# Altium schematic sheet Radio.SchDoc: PCA100024 - Radio
size A4; Revision: 1.0.0; SheetNumber: 1; SheetTotal: 3; DrawnBy: RUBR; ProjectNumber: 4400; PCBRevision: 0141RUBR; DocumentSize: A4; PCAName: PCA10024; PCBNumber: 400081; ProjectName: nRF51822 mbed
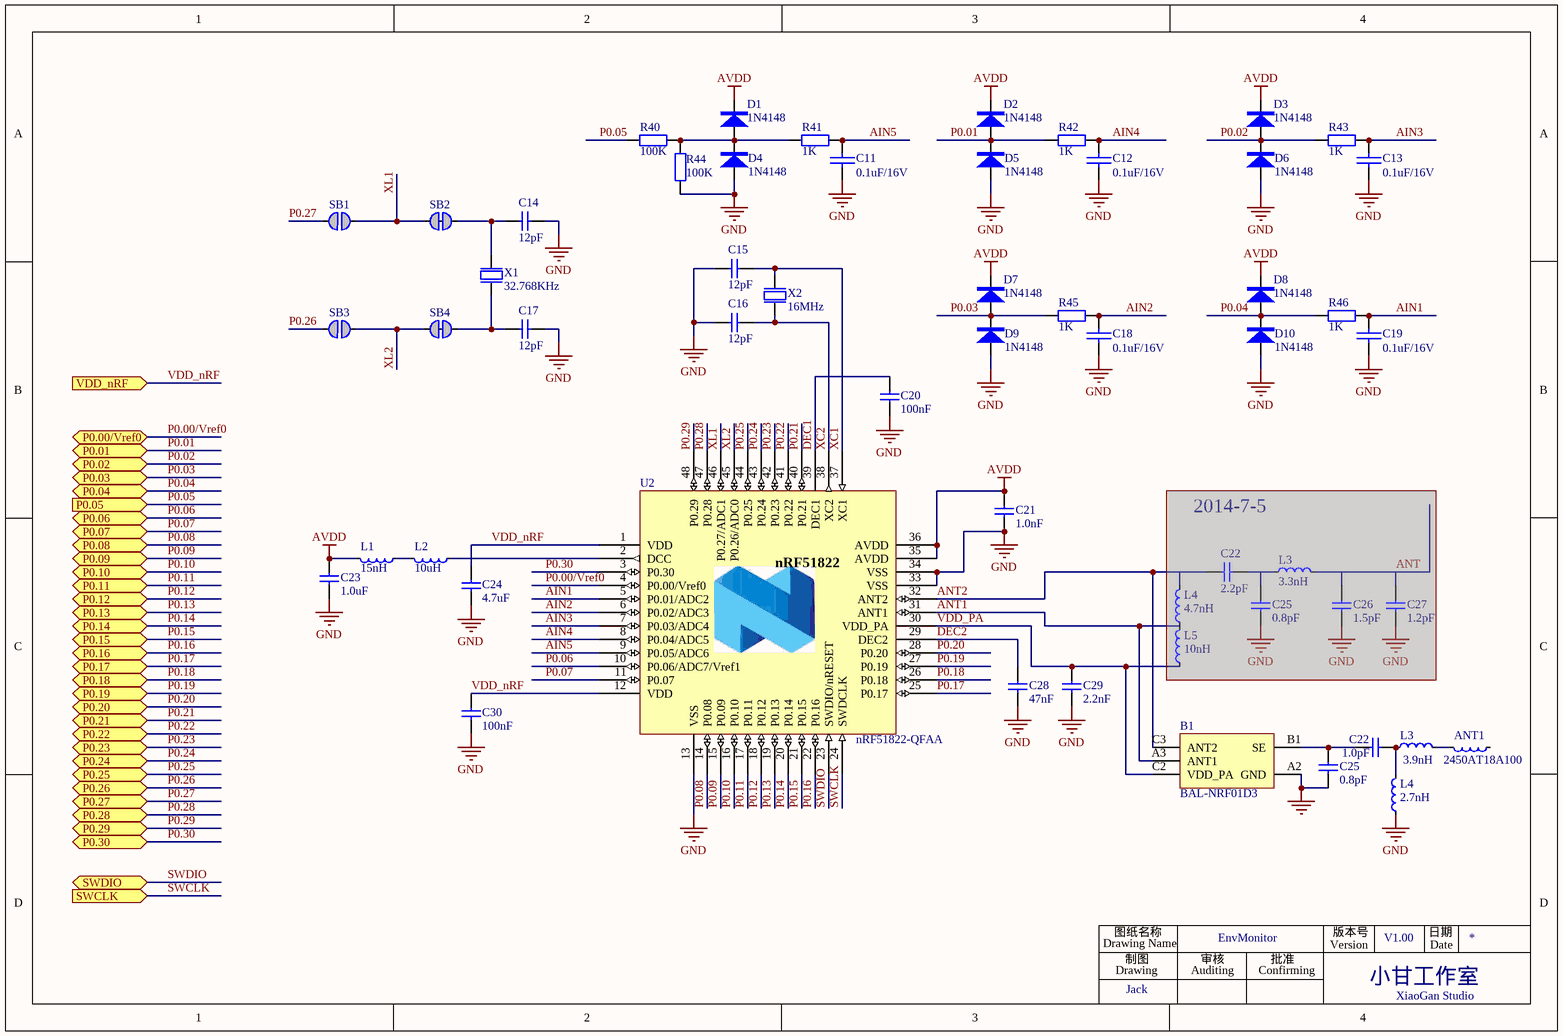
[diagram p0: Radio.SchDoc]

## Parts
(Parts that share a designator on the sheet are numbered #1, #2 ... from top to bottom, then left to right.)
ANT1  2450AT18A100
B1  BAL-NRF01D3  [BAL-ST-WLCSP]
C11  0.1uF/16V  [0603R]
C12  0.1uF/16V  [0603R]
C13  0.1uF/16V  [0603R]
C14  12pF  [0603R]
C15  12pF  [0603R]
C16  12pF  [0603R]
C17  12pF  [0603R]
C18  0.1uF/16V  [0603R]
C19  0.1uF/16V  [0603R]
C20  100nF  [0603R]
C21  1.0nF  [0603R]
C22#1  2.2pF  [0603R]  (masked out: inside a compile mask, not in the netlist)
C22#2  1.0pF  [0402c]
C23  1.0uF  [0603R]
C24  4.7uF  [0603R]
C25#1  0.8pF  [0603R]  (masked out: inside a compile mask, not in the netlist)
C25#2  0.8pF  [0402c]
C26  1.5pF  [0603R]  (masked out: inside a compile mask, not in the netlist)
C27  1.2pF  [0603R]  (masked out: inside a compile mask, not in the netlist)
C28  47nF  [0603R]
C29  2.2nF  [0603R]
C30  100nF  [0603R]
D1  1N4148  [SOD-123]
D2  1N4148  [SOD-123]
D3  1N4148  [SOD-123]
D4  1N4148  [SOD-123]
D5  1N4148  [SOD-123]
D6  1N4148  [SOD-123]
D7  1N4148  [SOD-123]
D8  1N4148  [SOD-123]
D9  1N4148  [SOD-123]
D10  1N4148  [SOD-123]
L1  15nH  [0603R]
L2  10uH  [0603R]
L3#1  3.3nH  [0603R]  (masked out: inside a compile mask, not in the netlist)
L3#2  3.9nH  [0402R]
L4#1  4.7nH  [0603R]  (masked out: inside a compile mask, not in the netlist)
L4#2  2.7nH  [0402R]
L5  10nH  [0603R]  (masked out: inside a compile mask, not in the netlist)
R40  100K  [0603R]
R41  1K  [0603R]
R42  1K  [0603R]
R43  1K  [0603R]
R44  100K  [0603R]
R45  1K  [0603R]
R46  1K  [0603R]
SB1  Solderbridge  [Solderbridge]  (value not drawn)  (no BOM)
SB2  Solderbridge  [Solderbridge_Shorted]  (value not drawn)  (net tie, no BOM)
SB3  Solderbridge  [Solderbridge]  (value not drawn)  (no BOM)
SB4  Solderbridge  [Solderbridge_Shorted]  (value not drawn)  (net tie, no BOM)
U2  nRF51822-QFAA  [QFN40P600X600X90-48N]
X1  32.768KHz  [CRY-32]
X2  16MHz  [XTAL-D]

## Ports
P0.00/Vref0 (bidir), P0.01 (bidir), P0.02 (bidir), P0.03 (bidir), P0.04 (bidir), P0.05 (in), P0.06 (bidir), P0.07 (bidir), P0.08 (bidir), P0.09 (bidir), P0.10 (bidir), P0.11 (bidir), P0.12 (bidir), P0.13 (bidir), P0.14 (bidir), P0.15 (bidir), P0.16 (bidir), P0.17 (bidir), P0.18 (bidir), P0.19 (bidir), P0.20 (bidir), P0.21 (bidir), P0.22 (bidir), P0.23 (bidir), P0.24 (bidir), P0.25 (bidir), P0.26 (bidir), P0.27 (bidir), P0.28 (bidir), P0.29 (bidir), P0.30 (bidir), SWCLK (in), SWDIO (bidir), VDD_nRF (in)

## Nets
AVDD: C21.1 C23.2 D1.2 D2.2 D3.2 D7.2 D8.2 L1.2 U2.35(AVDD) U2.36(AVDD)
GND: B1.A2(GND) C11.2(P2) C12.2(P2) C13.2(P2) C14.2 C15.2 C16.2 C17.2 C18.2(P2) C19.2(P2) C20.2 C21.2 C23.1 C24.2 C25#2.1 C28.2 C29.2 C30.2 D4.1 D5.1 D6.1 D9.1 D10.1 L4#2.1 R44.1 U2.13(VSS) U2.33(VSS) U2.34(VSS) U2.49
AIN1: C19.1(P1) R46.2 U2.5(P0.01/ADC2)
AIN2: C18.1(P1) R45.2 U2.6(P0.02/ADC3)
AIN3: C13.1(P1) R43.2 U2.7(P0.03/ADC4)
AIN4: C12.1(P1) R42.2 U2.8(P0.04/ADC5)
AIN5: C11.1(P1) R41.2 U2.9(P0.05/ADC6)
ANT1: B1.A3(ANT1) U2.31(ANT1)
ANT2: B1.C3(ANT2) U2.32(ANT2)
DEC1: C20.1 U2.39(DEC1)
DEC2: C28.1 U2.29(DEC2)
P0.00/Vref0: U2.4(P0.00/Vref0) ; port P0.00/Vref0
P0.01: D2.1 D5.2 R42.1 ; port P0.01
P0.02: D3.1 D6.2 R43.1 ; port P0.02
P0.03: D7.1 D9.2 R45.1 ; port P0.03
P0.04: D8.1 D10.2 R46.1 ; port P0.04
P0.05: R40.2 ; port P0.05
P0.06: U2.10(P0.06/ADC7/Vref1) ; port P0.06
P0.07: U2.11(P0.07) ; port P0.07
P0.08: U2.14(P0.08) ; port P0.08
P0.09: U2.15(P0.09) ; port P0.09
P0.10: U2.16(P0.10) ; port P0.10
P0.11: U2.17(P0.11) ; port P0.11
P0.12: U2.18(P0.12) ; port P0.12
P0.13: U2.19(P0.13) ; port P0.13
P0.14: U2.20(P0.14) ; port P0.14
P0.15: U2.21(P0.15) ; port P0.15
P0.16: U2.22(P0.16) ; port P0.16
P0.17: U2.25(P0.17) ; port P0.17
P0.18: U2.26(P0.18) ; port P0.18
P0.19: U2.27(P0.19) ; port P0.19
P0.20: U2.28(P0.20) ; port P0.20
P0.21: U2.40(P0.21) ; port P0.21
P0.22: U2.41(P0.22) ; port P0.22
P0.23: U2.42(P0.23) ; port P0.23
P0.24: U2.43(P0.24) ; port P0.24
P0.25: U2.44(P0.25) ; port P0.25
P0.26: SB3.2 ; port P0.26
P0.27: SB1.2 ; port P0.27
P0.28: U2.47(P0.28) ; port P0.28
P0.29: U2.48(P0.29) ; port P0.29
P0.30: U2.3(P0.30) ; port P0.30
SWCLK: U2.24(SWDCLK) ; port SWCLK
SWDIO: U2.23(SWDIO/nRESET) ; port SWDIO
VDD_nRF: C24.1 C30.1 U2.1(VDD) U2.12(VDD) ; port VDD_nRF
VDD_PA: B1.C2(VDD_PA) C29.1 U2.30(VDD_PA)
XC1: C15.1 U2.37(XC1) X2.2(out)
XC2: C16.1 U2.38(XC2) X2.1(inp)
XL1: SB1.1 SB2.2 U2.46(P0.27/ADC1)
XL2: SB3.1 SB4.2 U2.45(P0.26/ADC0)
NetANT1_2: ANT1.2 L3#2.2
NetB1_B1: B1.B1(SE) C22#2.1 C25#2.2
NetC14_1: C14.1 SB2.1 X1.2(out)
NetC17_1: C17.1 SB4.1 X1.1(inp)
NetC22#2_2: C22#2.2 L3#2.1 L4#2.2
NetD1_1: D1.1 D4.2 R40.1 R41.1 R44.2
NetL1_1: L1.1 L2.2
NetL2_1: L2.1 U2.2(DCC)

Not connected (* = marked no-connect by the designer): ANT1 1

## Notes on the sheet
- 2014-7-5
- Drawing Name
- 图纸名称
- Drawing
- 制图
- Auditing
- 审核
- EnvMonitor
- Confirming
- 批准
- Version
- 版本号
- 小甘工作室
- V1.00
- 日期
- Date
- Jack
- XiaoGan Studio
- (in symbol nRF51822_QFAA) nRF51822

## Library data of the parts
ANT1 L3#2 L4#2 = L0402-3n3: Inductor, 190mA, ?.1nH; Manufacturer: Murata; Manufacturer Part Number: LQP15MN3N3B02D; Value: 3.3nH; Note: High frequency chip inductor ?%; Artikkelnr Noca: 33029369; Part Number: L0402-3n3; Datasheet: http://search.murata.co.jp/Ceramy/image/img/PDF/ENG/L0075S0084LQP15M.pdf; LatestRevisionDate: 2012-09-19; Pin Count: 2; Publisher: Nordic Semiconductor; Published: 2009-05-08; Supplier: Digi-Key; Supplier part number: 490-1130-1-ND; 2nd source Supplier: *; 2nd source part number: *
B1 = BAL-NRF02D3: 50 ohm balun transformer for 2.45GHz ISM; Manufacturer: ST; Artikkelnr Noca: N.A.; Part Number: BAL-NRF02D3; Manufacturer Part Number: BAL-NRF02D3; Datasheet: *; LatestRevisionDate: 2013-05-15; Pin Count: 5; Publisher: Nordic Semiconductor; Published: 2013-05-15; Value: BAL-NRF02D3; Note: BAL-NRF02D3; Supplier: *; Supplier part number: *; 2nd source Supplier: *; 2nd source part number: *
C11-C13 C18 C19 = CAP: 贴片陶瓷电容; Kind: 贴片陶瓷电容
C14-C17 = C0402-12p: Capacitor, NP0, ?%; Note: 50V; Artikkelnr Noca: 20029159; Part Number: C0402-12p; Manufacturer: *; Manufacturer Part Number: *; Datasheet: *; LatestRevisionDate: 2011-05-11; Pin Count: 2; Publisher: Nordic Semiconductor; Published: 2009-05-08; Value: 12pF; Supplier: *; Supplier part number: *; 2nd source Supplier: *; 2nd source part number: *
C20 C30 = C0402-100n: Capacitor, X7R, ?0%; Note: 16V; Artikkelnr Noca: 20039200; Part Number: C0402-100n; Manufacturer: *; Manufacturer Part Number: *; Datasheet: *; LatestRevisionDate: 2009-11-23; Pin Count: 2; Publisher: Nordic Semiconductor; Published: 2009-05-08; Value: 100nF; Supplier: *; Supplier part number: *; 2nd source Supplier: *; 2nd source part number: *
C21 = C0402-1n0: Capacitor, X7R, ?0%; Note: 50V; Artikkelnr Noca: 20039223; Part Number: C0402-1n0; Manufacturer: *; Manufacturer Part Number: *; Datasheet: *; LatestRevisionDate: 2009-11-23; Pin Count: 2; Publisher: Nordic Semiconductor; Published: 2009-05-08; Value: 1.0nF; Supplier: *; Supplier part number: *; 2nd source Supplier: *; 2nd source part number: *
C22#1 = C0402-2.2p: Capacitor, NP0, ?.1pF; Note: 50V; Artikkelnr Noca: 20029145; Part Number: C0402-2.2p; Manufacturer: *; Manufacturer Part Number: *; Datasheet: *; LatestRevisionDate: 2009-05-08; Pin Count: 2; Publisher: Nordic Semiconductor; Published: 2009-05-08; Value: 2.2pF; Supplier: *; Supplier part number: *; 2nd source Supplier: *; 2nd source part number: *
C22#2 = C0402-0.8p: Capacitor, NP0, ?%; Value: 0.8pF; Note: 50V; Artikkelnr Noca: 20029147; Part Number: C0402-0.8p; Manufacturer: *; Manufacturer Part Number: *; Datasheet: *; LatestRevisionDate: 2012-11-21; Pin Count: 2; Publisher: Nordic Semiconductor; Published: 2009-05-08; Supplier: *; Supplier part number: *; 2nd source Supplier: *; 2nd source part number: *
C23 = C0603-1?: Capacitor, X7R, ?0%; Value: 1.0µF; Note: 16V; Artikkelnr Noca: 20039335; Part Number: C0603-1?; Manufacturer: *; Manufacturer Part Number: *; Datasheet: *; Footprint: 0603; LatestRevisionDate: 2013-06-05; Pin Count: 2; Publisher: Nordic Semiconductor; Published: 2009-05-08; Supplier: *; Supplier part number: *; 2nd source Supplier: *; 2nd source part number: *
C24 = C0603-4?: Capacitor, X5R, ?0%; Value: 4.7µF; Note: 6.3V; Artikkelnr Noca: 20069060; Part Number: C0603-4?; Manufacturer: *; Manufacturer Part Number: *; Datasheet: *; Footprint: 0603; LatestRevisionDate: 2009-11-23; Pin Count: 2; Publisher: Nordic Semiconductor; Published: 2009-05-08; Supplier: *; Supplier part number: *; 2nd source Supplier: *; 2nd source part number: *
C25#1 C25#2 = C0402-0.8p: Capacitor, NP0, ?%; Note: 50V; Artikkelnr Noca: 20029147; Part Number: C0402-0.8p; Manufacturer: *; Manufacturer Part Number: *; Datasheet: *; LatestRevisionDate: 2012-11-21; Pin Count: 2; Publisher: Nordic Semiconductor; Published: 2009-05-08; Value: 0.8pF; Supplier: *; Supplier part number: *; 2nd source Supplier: *; 2nd source part number: *
C26 = C0402-1.5p: Capacitor, NP0, ?.1pF; Note: 50V; Artikkelnr Noca: 20029139; Part Number: C0402-1.5p; Manufacturer: *; Manufacturer Part Number: *; Datasheet: *; LatestRevisionDate: 2009-11-23; Pin Count: 2; Publisher: Nordic Semiconductor; Published: 2009-05-08; Value: 1.5pF; Supplier: *; Supplier part number: *; 2nd source Supplier: *; 2nd source part number: *
C27 = C0402-1.2p: Capacitor, NP0, ?.1pF; Note: 50V; Artikkelnr Noca: 20029157; Part Number: C0402-1.2p; Manufacturer: *; Manufacturer Part Number: *; Datasheet: *; LatestRevisionDate: 2011-05-11; Pin Count: 2; Publisher: Nordic Semiconductor; Published: 2009-05-08; Value: 1.2pF; Supplier: *; Supplier part number: *; 2nd source Supplier: *; 2nd source part number: *
C28 = C0402-47n: Capacitor, X7R, ?0%; Note: Chip Cap 10%; Artikkelnr Noca: 20039389; Part Number: C0402-47n; Manufacturer: *; Manufacturer Part Number: *; Datasheet: *; LatestRevisionDate: 2009-05-08; Pin Count: 2; Publisher: Nordic Semiconductor; Published: 2009-05-08; Value: 47nF; Supplier: *; Supplier part number: *; 2nd source Supplier: *; 2nd source part number: *
C29 = C0402-2n2: Capacitor, X7R, ?0%; Note: 50V; Artikkelnr Noca: 20039221; Part Number: C0402-2n2; Manufacturer: *; Manufacturer Part Number: *; Datasheet: *; LatestRevisionDate: 2009-11-23; Pin Count: 2; Publisher: Nordic Semiconductor; Published: 2009-05-08; Value: 2.2nF; Supplier: *; Supplier part number: *; 2nd source Supplier: *; 2nd source part number: *
D1-D10 = DIODE: 贴片二极管; Remark: 可用1N5819替代; Kind: 贴片二极管
L1 = L0402-15n: Inductor, 320mA, ?%; Manufacturer: Taiyo Yuden; Manufacturer Part Number: HK100515NJ-T; 2nd source part number: 658-1328; Note: High frequency chip inductor ?0%; Artikkelnr Noca: 33029323; Part Number: L0402-15n; LatestRevisionDate: 2012-09-19; Pin Count: 2; Publisher: Nordic Semiconductor; Published: 2010-07-12; Value: 15nH; Supplier: Digi-Key; Datasheet: http://www.yuden.co.jp/productdata/catalog/en/mlci04_e.pdf; Supplier part number: 587-1521-1-ND; 2nd source Supplier: Farnell
L2 = L0603-10?: Inductor, 80mA, ?0%; Part Number: L0603-10祹ISHIDDEN=T; Manufacturer: Taiyo Yuden; Manufacturer Part Number: LBMF1608T100K; 2nd source part number: 178-6105; Value: 10µH; Note: LBMF1608T100K 10µH 80mA 0603; Artikkelnr Noca: 33029314; Datasheet: http://www.yuden.co.jp/ut/product/pdf/elb2_e.pdf; LatestRevisionDate: 2012-09-19; Pin Count: 2; Publisher: Nordic Semiconductor; Published: 2010-02-24; Supplier: Digi-Key; Supplier part number: 587-1714-1-ND; 2nd source Supplier: Farnell
L3#1 = L0402-3n3: Inductor, 190mA, ?.1nH; Manufacturer: Murata; Manufacturer Part Number: LQP15MN3N3B02D; Note: High frequency chip inductor ?%; Artikkelnr Noca: 33029369; Part Number: L0402-3n3; Datasheet: http://search.murata.co.jp/Ceramy/image/img/PDF/ENG/L0075S0084LQP15M.pdf; LatestRevisionDate: 2012-09-19; Pin Count: 2; Publisher: Nordic Semiconductor; Published: 2009-05-08; Value: 3.3nH; Supplier: Digi-Key; Supplier part number: 490-1130-1-ND; 2nd source Supplier: *; 2nd source part number: *
L4#1 = L0402-4n7: Inductor, 160mA, ?.1nH; Manufacturer: Murata; Manufacturer Part Number: LQP15MN4N7B02D; Note: High frequency chip inductor ?%; Artikkelnr Noca: 33029164; Part Number: L0402-4n7; Datasheet: http://search.murata.co.jp/Ceramy/image/img/PDF/ENG/L0075S0084LQP15M.pdf; LatestRevisionDate: 2012-09-19; Pin Count: 2; Publisher: Nordic Semiconductor; Published: 2009-05-08; Value: 4.7nH; Supplier: Digi-Key; Supplier part number: 490-1132-1-ND; 2nd source Supplier: *; 2nd source part number: *
L5 = L0402-10n: Inductor, 100mA, ?%; Manufacturer: Murata; Manufacturer Part Number: LQP15MN10NG02D; Note: High frequency chip inductor ?%; Artikkelnr Noca: 33029425; Part Number: L0402-10n; Datasheet: http://search.murata.co.jp/Ceramy/image/img/PDF/ENG/L0075S0084LQP15M.pdf; LatestRevisionDate: 2012-09-19; Pin Count: 2; Publisher: Nordic Semiconductor; Published: 2010-07-12; Value: 10nH; Supplier: Mouser; Supplier part number: 81-LQP15MN10NG02D; 2nd source Supplier: *; 2nd source part number: *
R40-R46 = RES_0603: OEMs: *; Type: 10KΩ; Package: 0603
SB1 SB3 = Solderbridge: Artikkelnr Noca: N.A.; Part Number: Solderbridge; Manufacturer: *; Manufacturer Part Number: *; Datasheet: *; LatestRevisionDate: 2009-12-14; Pin Count: 2; Publisher: Nordic Semiconductor; Published: 2009-12-14; Value: Solderbridge; Note: *; Supplier: *; Supplier part number: *; 2nd source Supplier: *; 2nd source part number: *
SB2 SB4 = Solderbridge Shorted: Shorted Solderbridge; Artikkelnr Noca: N.A.; Part Number: Solderbridge Shorted; Manufacturer: *; Manufacturer Part Number: *; Datasheet: *; LatestRevisionDate: 2012-08-07; Pin Count: 2; Publisher: Nordic Semiconductor; Published: 2012-08-07; Value: Solderbridge; Note: *; Supplier: *; Supplier part number: *; 2nd source Supplier: *; 2nd source part number: *
U2 = nRF51822_QFAA: Multi-protocol Bluetooth Low Energy and 2.4GHz proprietary system-on-chip; Part Number: nRF51822-QFAA-XLR2.4; Manufacturer: Nordic Semiconductor; Manufacturer Part Number: nRF51822-QFAAGx; Note: nRF51822 - QFN48 6x6 0.4mm pitch; Artikkelnr Noca: 15079242; Datasheet: *; Footprint: QFN-48; LatestRevisionDate: 2013-10-18; Pin Count: 48; Publisher: Nordic Semiconductor; Published: 2013-09-04; Value: nRF51822-QFAA; Supplier: Nordic Semiconductor; Supplier part number: *; 2nd source Supplier: *; 2nd source part number: *
X1 X2 = XTAL_FC-135 32.768k: EPSON TOYOCOM - FC-135 32.768KHZ ?0PPM,9.0PF - CRYSTAL, SM, WATCH; 2nd source part number: 127-8037; Note: XTAL SMD 32.768kHz, 3215; Artikkelnr Noca: 22019091; Part Number: XTAL_FC-135 32.768k; Manufacturer: Epson Toyocom; Manufacturer Part Number: FC-135 32.768KHZ ?0PPM,9.0PF; Datasheet: http://www.farnell.com/datasheets/57480.pdf; Footprint: FC-135; LatestRevisionDate: 2010-10-18; Pin Count: 2; Publisher: Nordic Semiconductor; Published: 2010-10-18; Value: 32.768kHz; Supplier: Digi-Key; Supplier part number: FC-135 32.7680KA-AC-ND; 2nd source Supplier: Farnell